# Altium schematic sheet mother1-picFacade.SchDoc
size A4
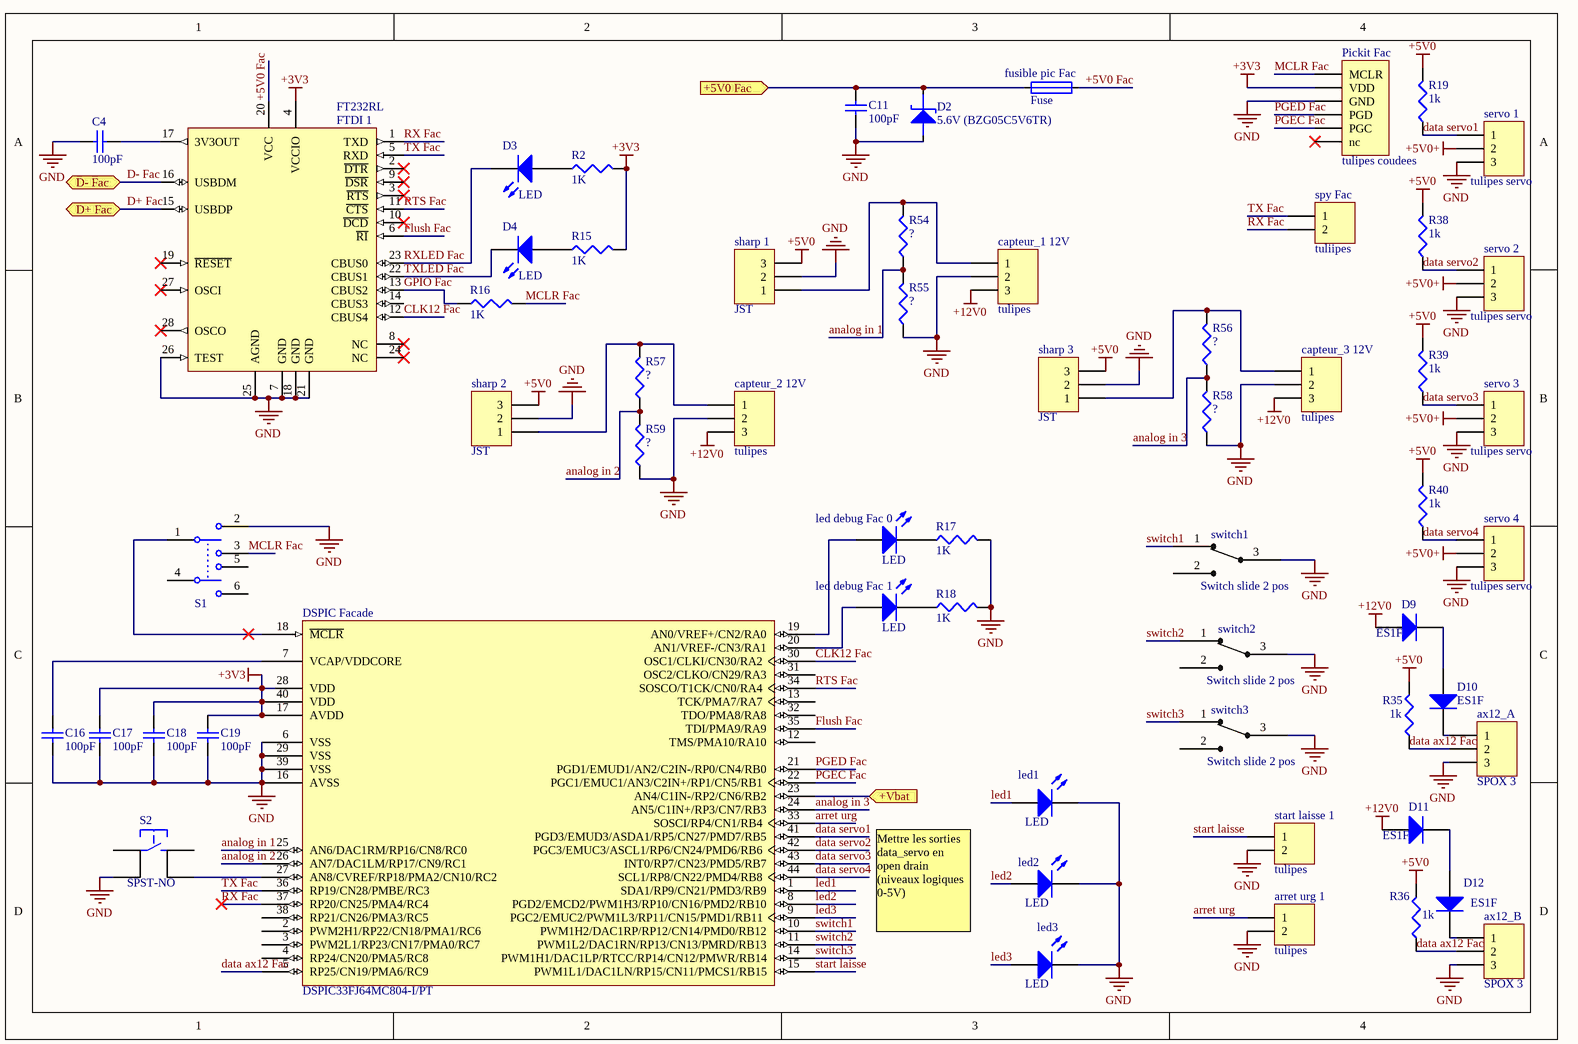
[diagram p0: mother1-picFacade.SchDoc]

## Parts
arret_urg_1  tulipes  [HDR1X2]
ax12_A  SPOX 3  [SPOX 2.5mm (x3)]
ax12_B  SPOX 3  [SPOX 2.5mm (x3)]
C4  value 100pF  [C0805C]  (hidden comment: CAP)
C11  value 100pF  [C0805C]  (hidden comment: CAP)
C16  value 100pF  [C0805C]  (hidden comment: CAP)
C17  value 100pF  [C0805C]  (hidden comment: CAP)
C18  value 100pF  [C0805C]  (hidden comment: CAP)
C19  value 100pF  [C0805C]  (hidden comment: CAP)
capteur_1_12V  tulipes  [HDR1X3]
capteur_2_12V  tulipes  [HDR1X3]
capteur_3_12V  tulipes  [HDR1X3]
D2  5.6V (BZG05C5V6TR)  [DSO-C2/X1.8]
D3  LED  [LED1206Y]
D4  LED  [LED1206Y]
D9  ES1F  [DSO-C2/X1.8]
D10  ES1F  [DSO-C2/X1.8]
D11  ES1F  [DSO-C2/X1.8]
D12  ES1F  [DSO-C2/X1.8]
DSPIC_Facade  DSPIC33FJ64MC804-I/PT  [TQFP-PT44_N]
FTDI_1  FT232RL  [SSOP-28_M]
fusible_pic_Fac  Fuse  [Fuse Holder 5x20mm]
led1  LED  [LED1206G]
led2  LED  [LED1206G]
led3  LED  [LED1206G]
led_debug_Fac_0  LED  [LED1206R]
led_debug_Fac_1  LED  [LED1206R]
Pickit_Fac  tulipes coudees  [HDR1X6H]
R2  value 1K  [C0805R]  (hidden comment: RES)
R15  value 1K  [C0805R]  (hidden comment: RES)
R16  value 1K  [C0805R]  (hidden comment: RES)
R17  value 1K  [C0805R]  (hidden comment: RES)
R18  value 1K  [C0805R]  (hidden comment: RES)
R19  value 1k  [C0805R]
R35  value 1k  [C0805R]
R36  value 1k  [C0805R]
R38  value 1k  [C0805R]
R39  value 1k  [C0805R]
R40  value 1k  [C0805R]
R54  RES  [C0805R]  (value not drawn)
R55  RES  [C0805R]  (value not drawn)
R56  RES  [C0805R]  (value not drawn)
R57  RES  [C0805R]  (value not drawn)
R58  RES  [C0805R]  (value not drawn)
R59  RES  [C0805R]  (value not drawn)
S1  SW-DPDT/Reset  [MCLSS22]  (value not drawn)
S2  SPST-NO  [SPST-NO]
servo_1  tulipes servo  [HDR1X3 - servo]
servo_2  tulipes servo  [HDR1X3 - servo]
servo_3  tulipes servo  [HDR1X3 - servo]
servo_4  tulipes servo  [HDR1X3 - servo]
sharp_1  JST  [B3B-PH-K-S]
sharp_2  JST  [B3B-PH-K-S]
sharp_3  JST  [B3B-PH-K-S]
spy_Fac  tuliipes  [HDR1X2]
start_laisse_1  tulipes  [HDR1X2]
switch1  Switch slide 2 pos  [Switch sur cosses 5.08mm]
switch2  Switch slide 2 pos  [Switch sur cosses 5.08mm]
switch3  Switch slide 2 pos  [Switch sur cosses 5.08mm]

## Ports
+5V0 Fac (in), +Vbat (in), D+ Fac (bidir), D- Fac (bidir)

## Nets
+3V3: C17.2 C18.2 C19.2 DSPIC_Facade.17(AVDD) DSPIC_Facade.28(VDD) DSPIC_Facade.40(VDD) FTDI_1.4(VCCIO) Pickit_Fac.2(VDD) R2.2 R15.2
+5V0: R19.2 R35.2 R36.2 R38.2 R39.2 R40.2 sharp_1.3 sharp_2.3 sharp_3.3
+5V0+: servo_1.2 servo_2.2 servo_3.2 servo_4.2
+12V0: capteur_1_12V.3 capteur_2_12V.3 capteur_3_12V.3 D9.1(A) D11.1(A)
GND: arret_urg_1.2 ax12_A.3 ax12_B.3 C4.2 C11.1 C16.1 C17.1 C18.1 C19.1 capteur_1_12V.2 capteur_2_12V.2 capteur_3_12V.2 D2.1(A) DSPIC_Facade.6(VSS) DSPIC_Facade.16(AVSS) DSPIC_Facade.29(VSS) DSPIC_Facade.39(VSS) FTDI_1.7(GND) FTDI_1.18(GND) FTDI_1.21(GND) FTDI_1.25(AGND) FTDI_1.26(TEST) led1.2(K) led2.2(K) led3.2(K) Pickit_Fac.3(GND) R17.2 R18.2 R55.1 R58.1 R59.1 S1.2 S2.2 servo_1.3 servo_2.3 servo_3.3 servo_4.3 sharp_1.2 sharp_2.2 sharp_3.2 start_laisse_1.2 switch1.3 switch2.3 switch3.3
+5V0 Fac: FTDI_1.20(VCC) fusible_pic_Fac.2
+5V0 Fac: C11.2 D2.2(K) fusible_pic_Fac.1 ; port +5V0 Fac  [a separate net that carries the same name]
+Vbat: DSPIC_Facade.23(AN4/C1IN-/RP2/CN6/RB2) ; port +Vbat
analog in 1: DSPIC_Facade.25(AN6/DAC1RM/RP16/CN8/RC0) R54.1 R55.2
analog in 2: DSPIC_Facade.26(AN7/DAC1LM/RP17/CN9/RC1) R57.1 R59.2
analog in 3: DSPIC_Facade.24(AN5/C1IN+/RP3/CN7/RB3) R56.1 R58.2
arret urg: arret_urg_1.1 DSPIC_Facade.33(SOSCI/RP4/CN1/RB4)
CLK12 Fac: DSPIC_Facade.30(OSC1/CLKI/CN30/RA2) FTDI_1.12(CBUS4)
D+ Fac: FTDI_1.15(USBDP) ; port D+ Fac
D- Fac: FTDI_1.16(USBDM) ; port D- Fac
data ax12 Fac: ax12_A.2 ax12_B.2 DSPIC_Facade.5(RP25/CN19/PMA6/RC9) R35.1 R36.1
data servo1: DSPIC_Facade.41(PGD3/EMUD3/ASDA1/RP5/CN27/PMD7/RB5) R19.1 servo_1.1
data servo2: DSPIC_Facade.42(PGC3/EMUC3/ASCL1/RP6/CN24/PMD6/RB6) R38.1 servo_2.1
data servo3: DSPIC_Facade.43(INT0/RP7/CN23/PMD5/RB7) R39.1 servo_3.1
data servo4: DSPIC_Facade.44(SCL1/RP8/CN22/PMD4/RB8) R40.1 servo_4.1
Flush Fac: DSPIC_Facade.35(TDI/PMA9/RA9) FTDI_1.6(~{RI})
GPIO Fac: FTDI_1.13(CBUS2) R16.1
led1: DSPIC_Facade.1(SDA1/RP9/CN21/PMD3/RB9) led1.1(A)
led2: DSPIC_Facade.8(PGD2/EMCD2/PWM1H3/RP10/CN16/PMD2/RB10) led2.1(A)
led3: DSPIC_Facade.9(PGC2/EMUC2/PWM1L3/RP11/CN15/PMD1/RB11) led3.1(A)
MCLR Fac: Pickit_Fac.1(MCLR) R16.2 S1.3
PGEC Fac: DSPIC_Facade.22(PGC1/EMUC1/AN3/C2IN+/RP1/CN5/RB1) Pickit_Fac.5(PGC)
PGED Fac: DSPIC_Facade.21(PGD1/EMUD1/AN2/C2IN-/RP0/CN4/RB0) Pickit_Fac.4(PGD)
RTS Fac: DSPIC_Facade.34(SOSCO/T1CK/CN0/RA4) FTDI_1.11(~{CTS})
RX Fac: DSPIC_Facade.37(RP20/CN25/PMA4/RC4) FTDI_1.1(TXD) spy_Fac.2
RXLED Fac: D3.2(K) FTDI_1.23(CBUS0)
start laisse: DSPIC_Facade.15(PWM1L1/DAC1LN/RP15/CN11/PMCS1/RB15) start_laisse_1.1
switch1: DSPIC_Facade.10(PWM1H2/DAC1RP/RP12/CN14/PMD0/RB12) switch1.1
switch2: DSPIC_Facade.11(PWM1L2/DAC1RN/RP13/CN13/PMRD/RB13) switch2.1
switch3: DSPIC_Facade.14(PWM1H1/DAC1LP/RTCC/RP14/CN12/PMWR/RB14) switch3.1
TX Fac: DSPIC_Facade.36(RP19/CN28/PMBE/RC3) FTDI_1.5(RXD) spy_Fac.1
TXLED Fac: D4.2(K) FTDI_1.22(CBUS1)
Netax12_A_1: ax12_A.1 D10.2(K)
Netax12_B_1: ax12_B.1 D12.2(K)
NetC4_1: C4.1 FTDI_1.17(3V3OUT)
NetC16_2: C16.2 DSPIC_Facade.7(VCAP/VDDCORE)
Netcapteur_1_12V_1: capteur_1_12V.1 R54.2 sharp_1.1
Netcapteur_2_12V_1: capteur_2_12V.1 R57.2 sharp_2.1
Netcapteur_3_12V_1: capteur_3_12V.1 R56.2 sharp_3.1
NetD3_1: D3.1(A) R2.1
NetD4_1: D4.1(A) R15.1
NetD9_2: D9.2(K) D10.1(A)
NetD11_2: D11.2(K) D12.1(A)
NetDSPIC_Facade_18: DSPIC_Facade.18(~{MCLR}) S1.1
NetDSPIC_Facade_19: DSPIC_Facade.19(AN0/VREF+/CN2/RA0) led_debug_Fac_0.1(A)
NetDSPIC_Facade_20: DSPIC_Facade.20(AN1/VREF-/CN3/RA1) led_debug_Fac_1.1(A)
NetDSPIC_Facade_27: DSPIC_Facade.27(AN8/CVREF/RP18/PMA2/CN10/RC2) S2.3
Netled_debug_Fac_0_2: led_debug_Fac_0.2(K) R17.1
Netled_debug_Fac_1_2: led_debug_Fac_1.2(K) R18.1

Not connected (* = marked no-connect by the designer): DSPIC_Facade 2(PWM2H1/RP22/CN18/PMA1/RC6) 3(PWM2L1/RP23/CN17/PMA0/RC7) 4(RP24/CN20/PMA5/RC8) 12(TMS/PMA10/RA10) 13(TCK/PMA7/RA7) 31(OSC2/CLKO/CN29/RA3) 32(TDO/PMA8/RA8) 38(RP21/CN26/PMA3/RC5); FTDI_1 2(~{DTR})* 3(~{RTS})* 8(NC)* 9(~{DSR})* 10(~{DCD})* 14(CBUS3) 19(~{RESET})* 24(NC)* 27(OSCI)* 28(OSCO)*; Pickit_Fac 6(nc)*; S1 4 5 6; S2 1 4; switch1 2; switch2 2; switch3 2

## Notes on the sheet
- Mettre les sorties data_servo en open drain (niveaux logiques 0-5V)
- Deux connecteurs si les AX-12 sont de part et d'autre du PCB

## Library data of the parts
arret_urg_1 spy_Fac start_laisse_1 = Header 2: Header, 2-Pin; LatestRevisionDate: 17-Jul-2002; LatestRevisionNote: Re-released for DXP Platform.; Publisher: Altium Limited
ax12_A ax12_B capteur_1_12V capteur_2_12V capteur_3_12V servo_1-servo_4 sharp_1-sharp_3 = Header 3: Header, 3-Pin; LatestRevisionDate: 17-Jul-2002; LatestRevisionNote: Re-released for DXP Platform.; Publisher: Altium Limited
C4 C11 C16-C19 = CAP: Capacitor; Published: 8-Jun-2000; LatestRevisionDate: 29-May-2009; LatestRevisionNote: IPC-7351 Footprint Added.; PackageReference: C1206; Publisher: Altium Limited; PackageDescription: Chip Capacitor
D2 = ZENER: Zener Diode
D3 D4 led_debug_Fac_0 led_debug_Fac_1 = LED2: Typical RED, GREEN, YELLOW, AMBER GaAs LED; Published: 8-Jun-2000; LatestRevisionDate: 17-Jul-2002; LatestRevisionNote: Re-released for DXP Platform.; PackageVersion: Feb-2002; PackageReference: 3.2X1.6X1.1; Publisher: Altium Limited; PackageDescription: SM LED; 2 Flat Leads
D9-D12 = Diode: Pour chute de tension; Published: 8-Jun-2000; LatestRevisionDate: 17-Jul-2002; LatestRevisionNote: Re-released for DXP Platform.; PackageVersion: Sep-1996; PackageReference: SMC; Publisher: Altium Limited; PackageDescription: DO-214-AB/SMC; 2 C-Bend Leads; Body 7.9 x 5.9 mm, inc. leads (LxW); Code_JEDEC: DO-214-AB
DSPIC_Facade = DSPIC33FJ64MC804-I/PT: High-Performance 16-bit Digital Signal Controller, 64 KB Flash, 16 KB RAM, 44-Pin TQFP, Industrial Temperature; Published: 2-Dec-2009; DatasheetVersion: revD, Nov-2009; PackageVersion: revBB, Aug-2009; PackageReference: TQFP-PT44; Publisher: Altium Limited; PackageDescription: 44-Lead Plastic Thin Quad Flatpack (PT) - 10x10x1mm Body, 2.00mm [TQFP]; Supplier 1: Digi-Key; Supplier Part Number 1: DSPIC33FJ64MC804-I/PT-ND; Supplier 2: Farnell; Supplier Part Number 2: 1576844; Code_JEDEC: MS-026; ComponentLink1Description: Datasheet; ComponentLink1URL: http://ww1.microchip.com/downloads/en/DeviceDoc/70291D.pdf; ComponentLink2Description: Packaging Specification; ComponentLink2URL: http://www.microchip.com/stellent/groups/techpub_sg/documents/packagingspec/en012702.pdf; ComponentLink3Description: Microchip.com Home; ComponentLink3URL: http://www.microchip.com/
FTDI_1 = FT232RL: USB UART Asynchronous Serial Data Transfer Chip, SSOP-28, Tube; Published: 19-Aug-2010; DatasheetVersion: ver 2.07, Jul-2010; PackageVersion: 2010; PackageReference: SSOP-28; Publisher: Altium Limited; PackageDescription: 28-Pin Small Outline Package 0.65 mm Pitch; ComponentLink1Description: Manufacturer Link; ComponentLink1URL: http://www.ftdichip.com/Products/ICs/FT232R.htm; ComponentLink2Description: Datasheet; ComponentLink2URL: http://www.ftdichip.com/Support/Documents/DataSheets/ICs/DS_FT232R.pdf
led1-led3 = LED: Typical RED, GREEN, YELLOW, AMBER GaAs LED; Published: 8-Jun-2000; LatestRevisionDate: 17-Jul-2002; LatestRevisionNote: Re-released for DXP Platform.; PackageVersion: Feb-2002; PackageReference: 3.2X1.6X1.1; Publisher: Altium Limited; PackageDescription: SM LED; 2 Flat Leads
Pickit_Fac = Header ICSP: Header, 6-Pin, Right Angle; LatestRevisionDate: 17-Jul-2002; LatestRevisionNote: Re-released for DXP Platform.; Publisher: Altium Limited
R2 R15-R18 R54-R59 = RES: Resistor; Published: 8-Jun-2000; LatestRevisionDate: 29-May-2009; LatestRevisionNote: IPC-7351 Footprint Added.; PackageReference: J1-0603; Publisher: Altium Limited; PackageDescription: Chip Resistor
  R54-R59: Value: ?
R19 R35 R36 R38-R40 = Res3: Resistor; Published: 8-Jun-2000; LatestRevisionDate: 29-May-2009; LatestRevisionNote: IPC-7351 Footprint Added.; PackageReference: J1-0603; Publisher: Altium Limited; PackageDescription: Chip Resistor
S1 = SW-DPDT: Double-Pole, Double-Throw Switch, ref MCLSS22; Published: 24-Mar-1999; LatestRevisionDate: 17-Jul-2002; LatestRevisionNote: Re-released for DXP Platform.; PackageReference: DPDT-6; Publisher: Altium Limited; PackageDescription: Switch; 6 Leads
S2 = SPST-NO: Tactile Switch 7.3mm, SMD
switch1-switch3 = Switch slide On/Off: Switch slide 2 positions